# EAGLE schematic Schematic_Base (EAGLE 8.2.1)
Change description here later
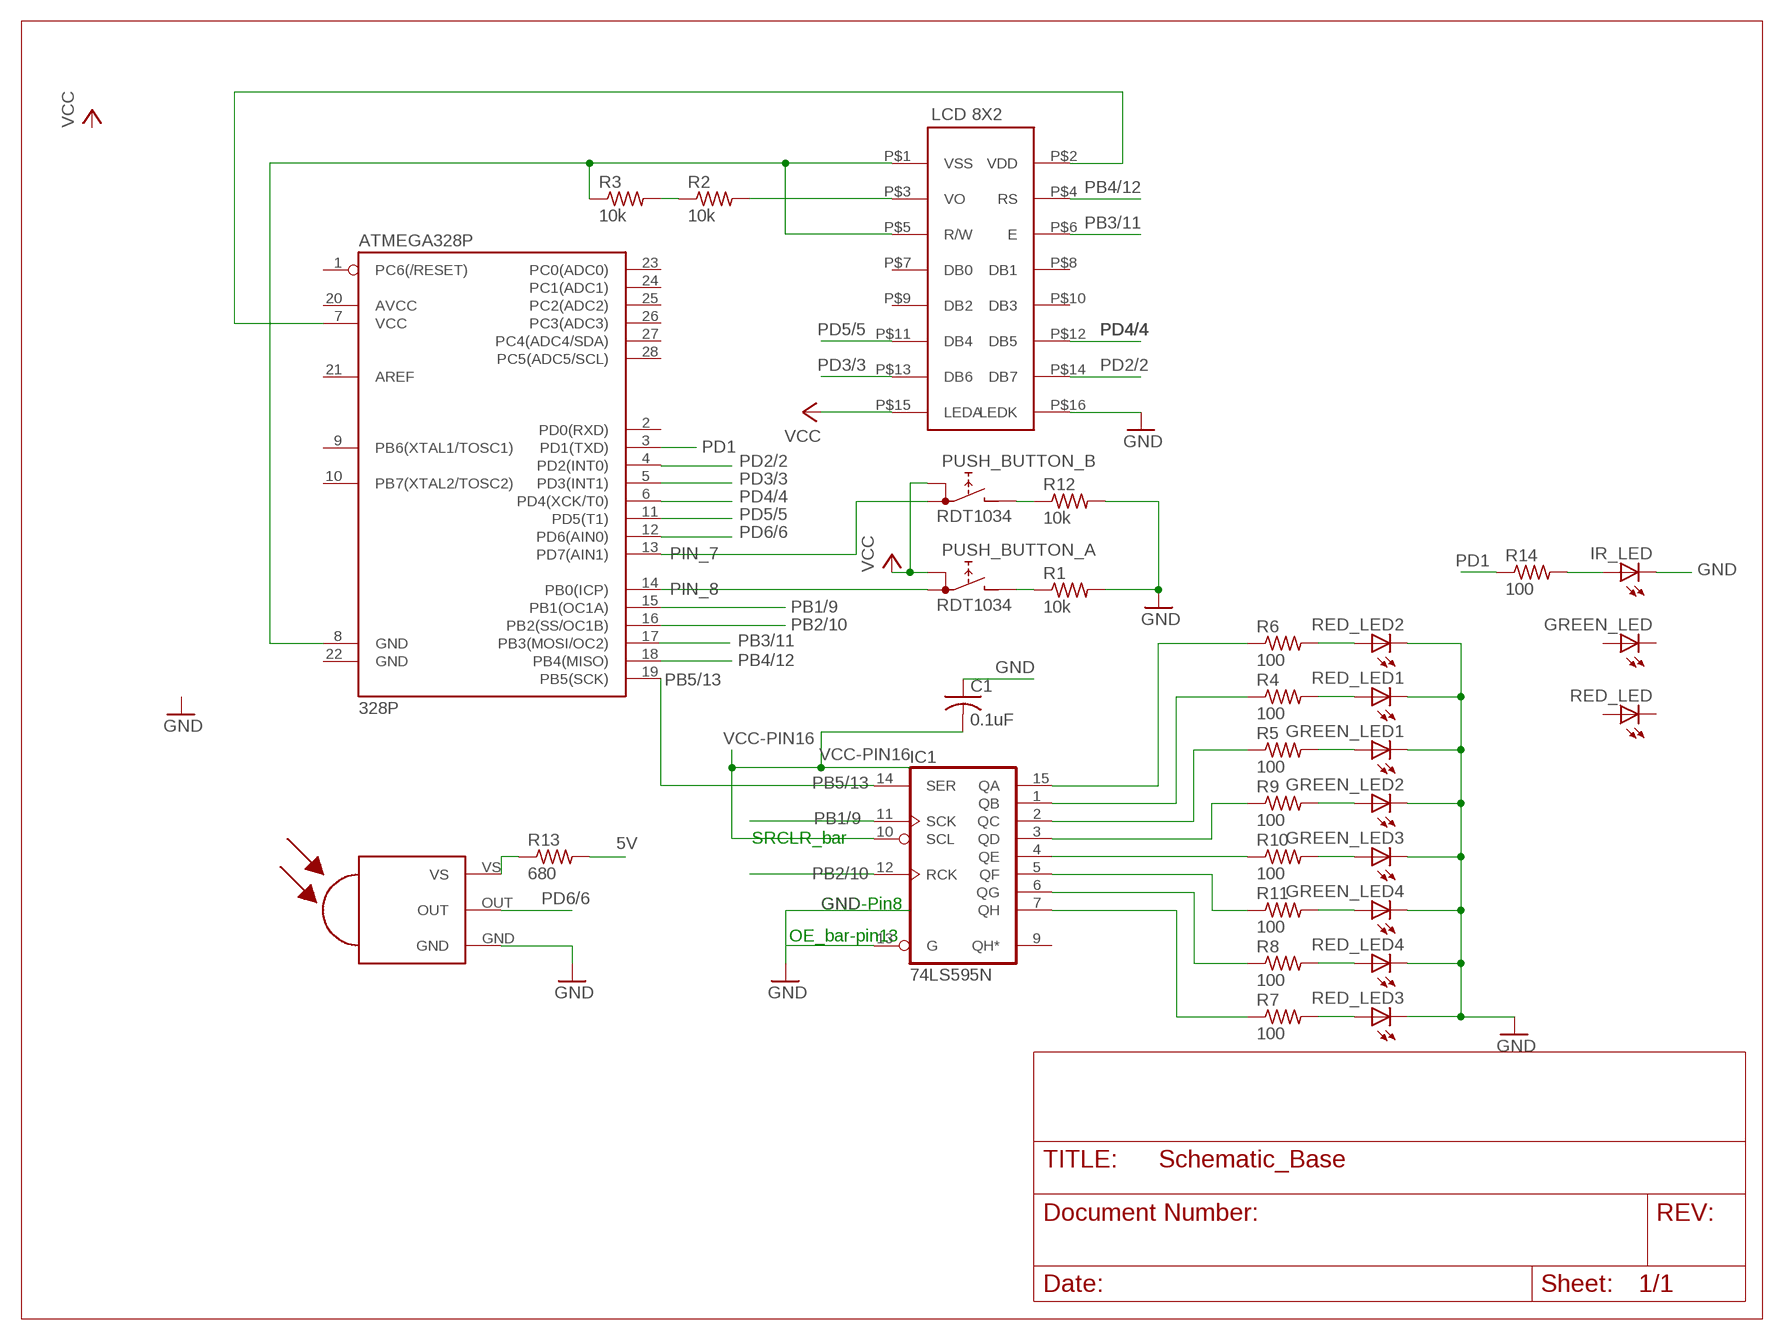
[diagram p0: schematic, sheet 1]

## Parts
ATMEGA328P  328P  ATMEGA328P_PDIP  [DIP28]
C1  0.1uF  C-US025-025X050  [C025-025X050]
GREEN_LED  LEDIRL80A  [IRL80A]
GREEN_LED1  LEDIRL80A  [IRL80A]
GREEN_LED2  LEDIRL80A  [IRL80A]
GREEN_LED3  LEDIRL80A  [IRL80A]
GREEN_LED4  LEDIRL80A  [IRL80A]
IC1  74LS595N  [DIL16]
IR_LED  LEDIRL80A  [IRL80A]
PUSH_BUTTON_A  RDT1034  [RDT1034]
PUSH_BUTTON_B  RDT1034  [RDT1034]
R1  10k  R-US_0207/12  [0207/12]
R2  10k  R-US_0207/12  [0207/12]
R3  10k  R-US_0207/12  [0207/12]
R4  100  R-US_0207/12  [0207/12]
R5  100  R-US_0207/12  [0207/12]
R6  100  R-US_0207/12  [0207/12]
R7  100  R-US_0207/12  [0207/12]
R8  100  R-US_0207/12  [0207/12]
R9  100  R-US_0207/12  [0207/12]
R10  100  R-US_0207/12  [0207/12]
R11  100  R-US_0207/12  [0207/12]
R12  10k  R-US_0207/12  [0207/12]
R13  680  R-US_0207/12  [0207/12]
R14  100  R-US_0207/12  [0207/12]
RED_LED  LEDIRL80A  [IRL80A]
RED_LED1  LEDIRL80A  [IRL80A]
RED_LED2  LEDIRL80A  [IRL80A]
RED_LED3  LEDIRL80A  [IRL80A]
RED_LED4  LEDIRL80A  [IRL80A]
U$1  LMB0820  [LMB0820_PACKAGE]
U$2  TSOP38238  [TSOP-382]

## Nets
5V: R13.2
GND: C1.1 GREEN_LED1.K(C) GREEN_LED2.K(C) GREEN_LED3.K(C) GREEN_LED4.K(C) IR_LED.K(C) R1.2 R12.2 RED_LED1.K(C) RED_LED2.K(C) RED_LED3.K(C) RED_LED4.K(C) U$1.P$16(LEDK) U$2.GND
N$1: ATMEGA328P.8(GND) R3.1 U$1.P$1(VSS) U$1.P$5(R/W)
N$2: ATMEGA328P.7(VCC) U$1.P$2(VDD)
N$3: PUSH_BUTTON_A.B R1.1
N$4: IC1.13(G)
N$5: R2.2 U$1.P$3(VO)
N$6: R2.1 R3.2
N$7: R4.2 RED_LED1.A
N$8: GREEN_LED1.A R5.2
N$9: R6.2 RED_LED2.A
N$10: R7.2 RED_LED3.A
N$11: R8.2 RED_LED4.A
N$12: GREEN_LED2.A R9.2
N$13: GREEN_LED3.A R10.2
N$14: GREEN_LED4.A R11.2
N$15: IC1.1(QB) R4.1
N$16: IC1.15(QA) R6.1
N$17: IC1.2(QC) R5.1
N$18: IC1.3(QD) R9.1
N$19: IC1.4(QE) R10.1
N$20: IC1.5(QF) R11.1
N$21: IC1.6(QG) R8.1
N$22: IC1.7(QH) R7.1
N$23: R13.1 U$2.VS
N$24: PUSH_BUTTON_B.B R12.1
N$25: IR_LED.A R14.2
PB1/9: IC1.11(SCK)
PB2/10: IC1.12(RCK)
PB3/11: U$1.P$6(E)
PB4/12: U$1.P$4(RS)
PB5/13: ATMEGA328P.19(PB5(SCK)) IC1.14(SER)
PD1: R14.1
PD2/2: U$1.P$14(DB7)
PD3/3: U$1.P$13(DB6)
PD4/4: U$1.P$12(DB5)
PD5/5: U$1.P$11(DB4)
PD6/6: U$2.OUT
PIN_7: ATMEGA328P.13(PD7(AIN1)) PUSH_BUTTON_B.A1
PIN_8: ATMEGA328P.14(PB0(ICP)) PUSH_BUTTON_A.A1
VCC: PUSH_BUTTON_A.A PUSH_BUTTON_B.A U$1.P$15(LEDA)
VCC-PIN16: C1.2 IC1.10(SCL)
Unconnected: ATMEGA328P.1(PC6(/RESET)) ATMEGA328P.2(PD0(RXD)) ATMEGA328P.3(PD1(TXD)) ATMEGA328P.4(PD2(INT0)) ATMEGA328P.5(PD3(INT1)) ATMEGA328P.6(PD4(XCK/T0)) ATMEGA328P.9(PB6(XTAL1/TOSC1)) ATMEGA328P.10(PB7(XTAL2/TOSC2)) ATMEGA328P.11(PD5(T1)) ATMEGA328P.12(PD6(AIN0)) ATMEGA328P.15(PB1(OC1A)) ATMEGA328P.16(PB2(SS/OC1B)) ATMEGA328P.17(PB3(MOSI/OC2)) ATMEGA328P.18(PB4(MISO)) ATMEGA328P.20(AVCC) ATMEGA328P.21(AREF) ATMEGA328P.22(GND) ATMEGA328P.23(PC0(ADC0)) ATMEGA328P.24(PC1(ADC1)) ATMEGA328P.25(PC2(ADC2)) ATMEGA328P.26(PC3(ADC3)) ATMEGA328P.27(PC4(ADC4/SDA)) ATMEGA328P.28(PC5(ADC5/SCL)) GREEN_LED.A GREEN_LED.K(C) IC1.9(QH*) RED_LED.A RED_LED.K(C) U$1.P$7(DB0) U$1.P$8(DB1) U$1.P$9(DB2) U$1.P$10(DB3)

## Notes on the sheet
- SRCLR_bar
- GND-Pin8
- OE_bar-pin13

## Power pins joined to a net without a drawn wire
GND: IC1.8(GND)
VCC: IC1.16(VCC)

## Library data of the parts
ATMEGA328P = SparkFun-IC-Microcontroller:ATMEGA328P_PDIP: Atmel 328P Through hole ATMEGA328P uC used in the Arduino 32kb flash, 1k EEPROM, 2k SRAM Datasheet <http://www.sparkfun.com/datasheets/Components/SMD/ATMega328.pdf> SparkFun Products Storefront component: AVR 28 Pin 20MHz 32K 6A/D - ATMega328P <https://www.sparkfun.com/products/9061> (COM-09061) SparkFun Simon Says - Through-Hole Soldering Kit <https://www.sparkfun.com/products/10547> (KIT-10547) SparkFun Learn to Solder - Simon Says <https://www.sparkfun.com/products/13708> (KIT-13708) SparkFun BigTime Watch Kit <https://www.sparkfun.com/products/11734> (KIT-11734) SparkFun ClockIt <https://www.sparkfun.com/products/10930> (KIT-10930) SparkFun Serial Enabled LCD Kit <https://www.sparkfun.com/products/10097> (LCD-10097) SparkFun Simon Tilts - Through Hole Soldering Kit <https://www.sparkfun.com/products/12634> (KIT-12634) SparkFun Frequency Counter Kit <https://www.sparkfun.com/products/10140> (KIT-10140) FabFM Radio Kit <https://www.sparkfun.com/products/11043> (KIT-11043) SparkFun Binary Blaster Kit <https://www.sparkfun.com/products/12037> (KIT-12037) SparkFun Metro-Gnome <https://www.sparkfun.com/products/9236> (KIT-09236) ATmega328 with Arduino Optiboot (Uno) <https://www.sparkfun.com/products/10524> (DEV-10524); PROD_ID: IC-09136
C1 = resistor:C-US: CAPACITOR, American symbol
GREEN_LED GREEN_LED1-GREEN_LED4 IR_LED RED_LED RED_LED1-RED_LED4 = led:LED: LED OSRAM: - CHIPLED LG R971, LG N971, LY N971, LG Q971, LY Q971, LO R971, LY R971 LH N974, LH R974 LS Q976, LO Q976, LY Q976 LO Q996 - Hyper CHIPLED LW Q18S LB Q993, LB Q99A, LB R99A - SideLED LS A670, LO A670, LY A670, LG A670, LP A670 LB A673, LV A673, LT A673, LW A673 LH A674 LY A675 LS A676, LA A676, LO A676, LY A676, LW A676 LS A679, LY A679, LG A679 - Hyper Micro SIDELED® LS Y876, LA Y876, LO Y876, LY Y876 LT Y87S - SmartLED LW L88C, LW L88S LB L89C, LB L89S, LG L890 LS L89K, LO L89K, LY L89K LS L896, LA L896, LO L896, LY L896 - TOPLED LS T670, LO T670, LY T670, LG T670, LP T670 LSG T670, LSP T670, LSY T670, LOP T670, LYG T670 LG T671, LOG T671, LSG T671 LB T673, LV T673, LT T673, LW T673 LH T674 LS T676, LA T676, LO T676, LY T676, LB T676, LH T676, LSB T676, LW T676 LB T67C, LV T67C, LT T67C, LS T67K, LO T67K, LY T67K, LW E67C LS E67B, LA E67B, LO E67B, LY E67B, LB E67C, LV E67C, LT E67C LW T67C LS T679, LY T679, LG T679 LS T770, LO T770, LY T770, LG T770, LP T770 LB T773, LV T773, LT T773, LW T773 LH T774 LS E675, LA E675, LY E675, LS T675 LS T776, LA T776, LO T776, LY T776, LB T776 LHGB T686 LT T68C, LB T68C - Hyper Mini TOPLED® LB M676 - Mini TOPLED Santana® LG M470 LS M47K, LO M47K, LY M47K Source: http://www.osram.convergy.de LUXEON: - LUMILED® LXK2-PW12-R00, LXK2-PW12-S00, LXK2-PW14-U00, LXK2-PW14-V00 LXK2-PM12-R00, LXK2-PM12-S00, LXK2-PM14-U00 LXK2-PE12-Q00, LXK2-PE12-R00, LXK2-PE12-S00, LXK2-PE14-T00, LXK2-PE14-U00 LXK2-PB12-K00, LXK2-PB12-L00, LXK2-PB12-M00, LXK2-PB14-N00, LXK2-PB14-P00, LXK2-PB14-Q00 LXK2-PR12-L00, LXK2-PR12-M00, LXK2-PR14-Q00, LXK2-PR14-R00 LXK2-PD12-Q00, LXK2-PD12-R00, LXK2-PD12-S00 LXK2-PH12-R00, LXK2-PH12-S00 LXK2-PL12-P00, LXK2-PL12-Q00, LXK2-PL12-R00 Source: www.luxeon.com KINGBRIGHT: KA-3528ASYC Source: www.kingbright.com
IC1 = 74xx-eu:74*595: 8-bit SHIFT REGISTER, output latch
PUSH_BUTTON_A PUSH_BUTTON_B = switch:RDT1034: PUSH SWITCH www.radiohm.com
R1-R14 = resistor:R-US_: RESISTOR, American symbol
U$1 = RC Custom:LMB0820: 8 x 2 LCD by Seeed 8 characters x 2 lines Custom schematic by Richard Chan
U$2 = TSOP38238:TSOP38238: 38 kHz 45 m 2.5-5.5 V Through Hole IR Receiver Module for Remote Control System; AVAILABILITY: Good; DESCRIPTION: 38 kHz 45 m 2.5-5.5 V Through Hole IR Receiver Module for Remote Control System; MF: Vishay; MP: TSOP38238; PACKAGE: None; PRICE: 0.52 USD